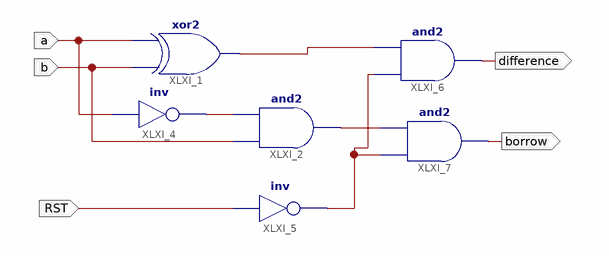
[diagram p0: schematic sheet 1]
// Xilinx ISE schematic half_subtractor.sch (artix7) as structural Verilog: 6 symbols, 5 ports
module half_subtractor (
  input  a,
  input  b,
  input  RST,
  output difference,
  output borrow
);

  wire XLXN_10, XLXN_12, XLXN_16, XLXN_17;

  xor XLXI_1 (XLXN_16, b, a);
  and XLXI_2 (XLXN_17, b, XLXN_10);
  not XLXI_4 (XLXN_10, a);
  not XLXI_5 (XLXN_12, RST);
  and XLXI_6 (difference, XLXN_12, XLXN_16);
  and XLXI_7 (borrow, XLXN_12, XLXN_17);
endmodule
